# Altium schematic sheet MainBoard V03.SchDoc
size A3
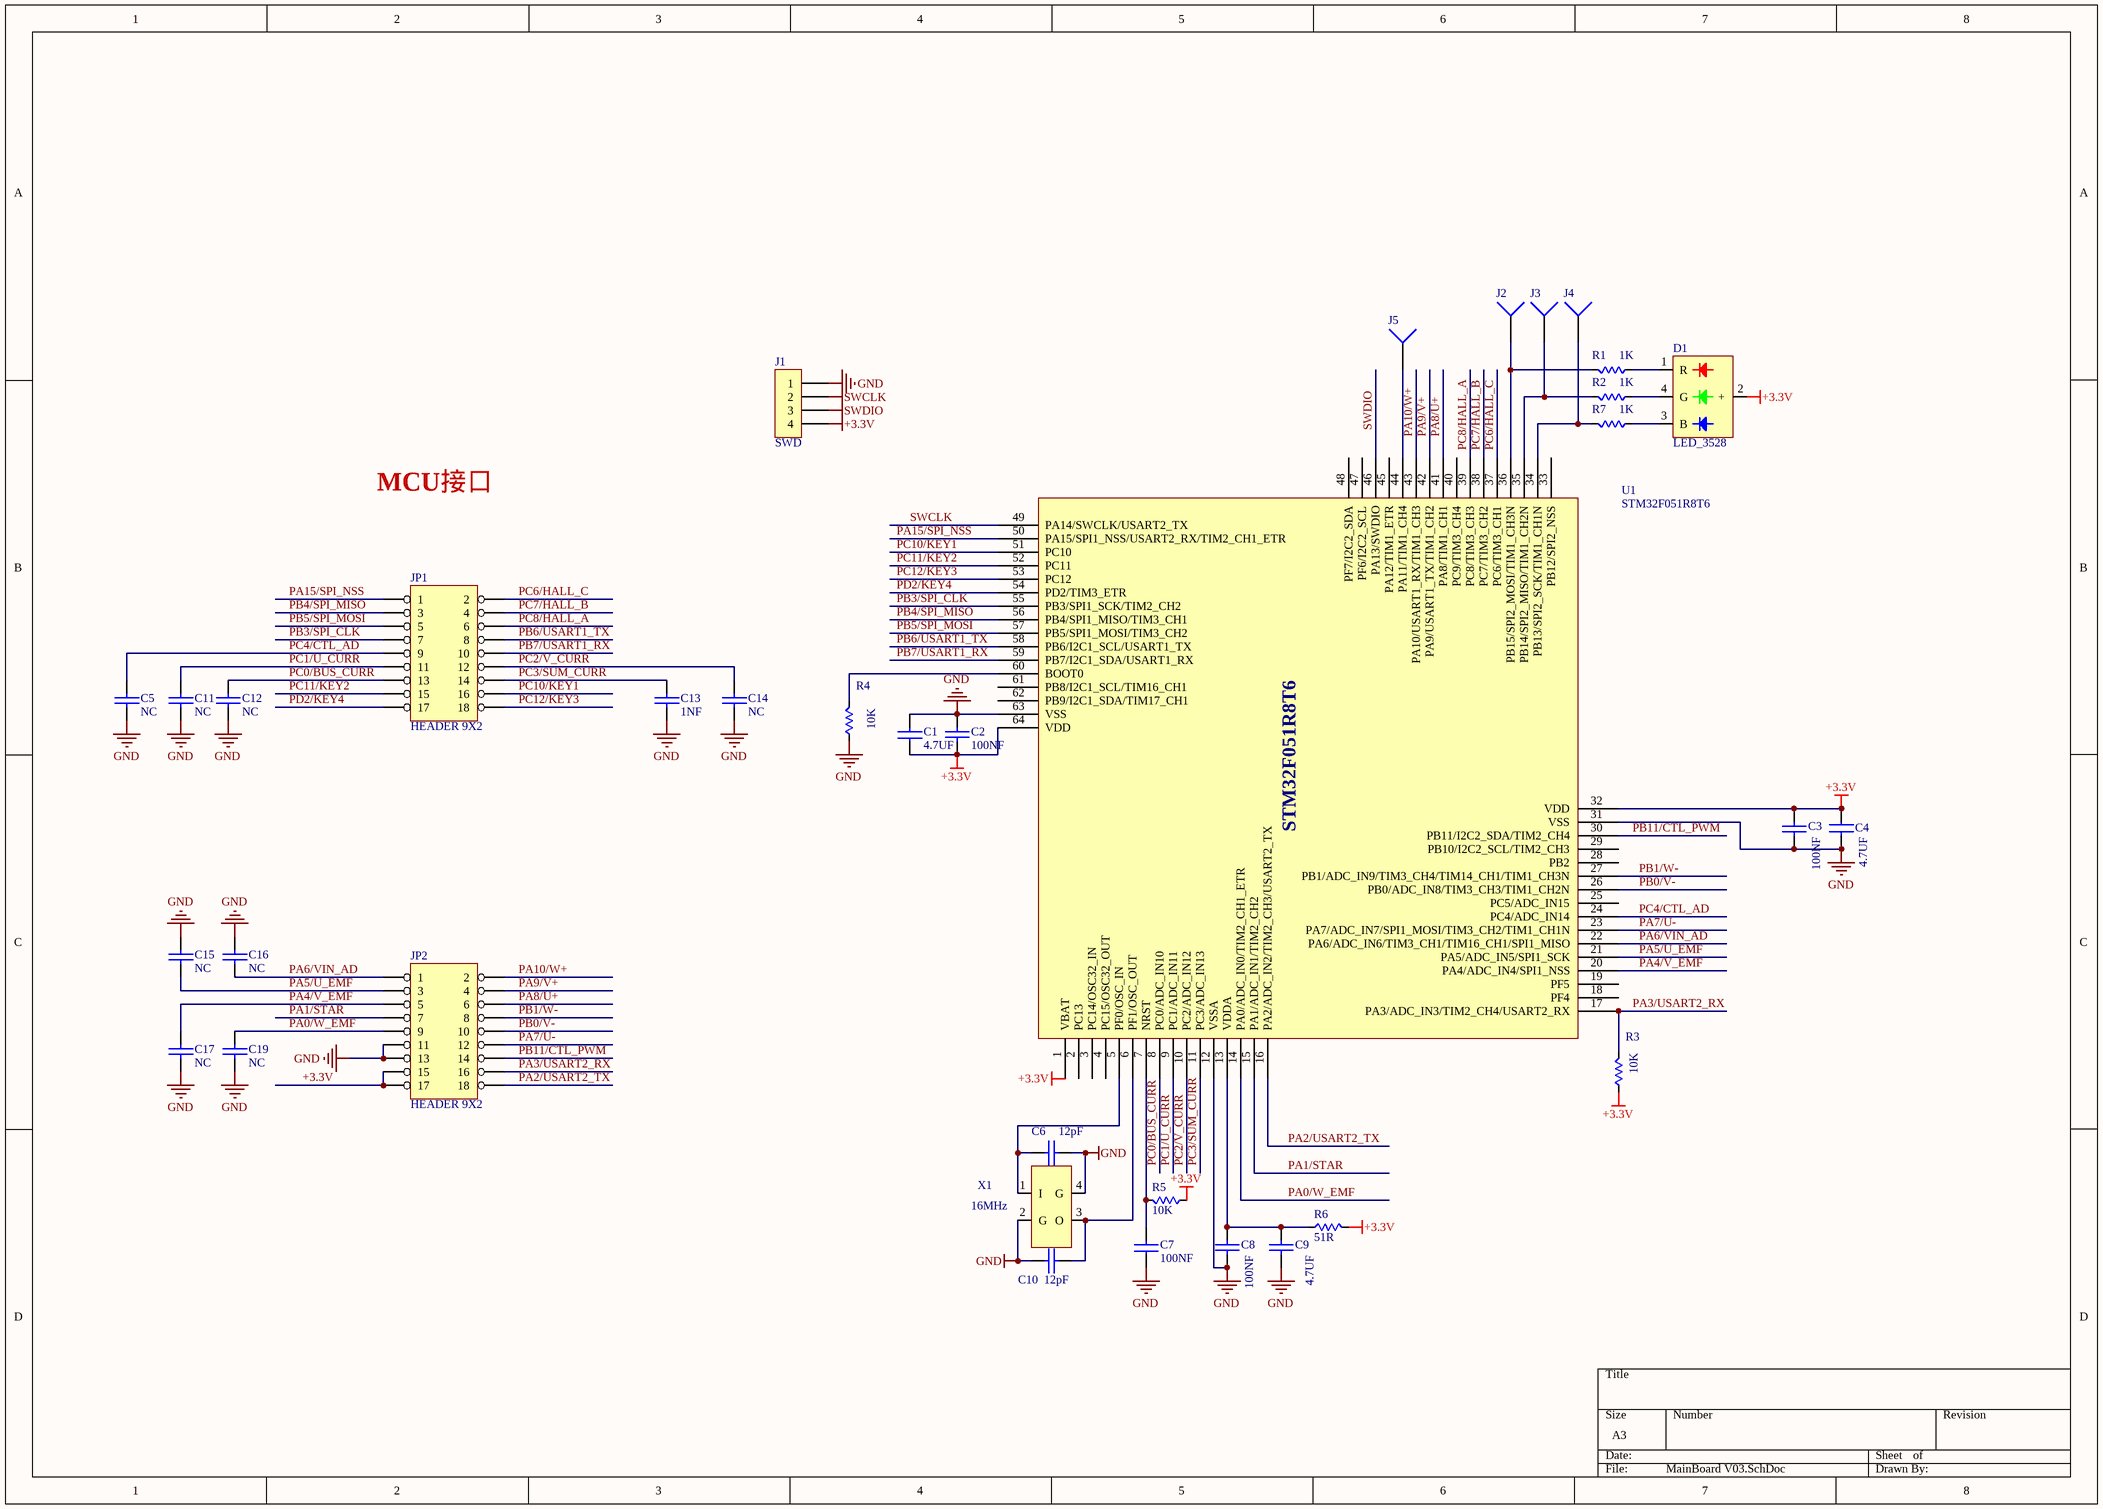
[diagram p0: MainBoard V03.SchDoc]

## Parts
C1  4.7UF  [0805C]
C2  100NF  [0603C]
C3  100NF  [0603C]
C4  4.7UF  [0805C]
C5  NC  [0603C]
C6  12pF  [0603C]
C7  100NF  [0603C]
C8  100NF  [0603C]
C9  4.7UF  [0805C]
C10  12pF  [0603C]
C11  NC  [0603C]
C12  NC  [0603C]
C13  1NF  [0603C]
C14  NC  [0603C]
C15  NC  [0603C]
C16  NC  [0603C]
C17  NC  [0603C]
C19  NC  [0603C]
D1  LED_3528  [LED3528]
J1  SWD  [SIP4]
J2  (no value)  [TPJ1.3A]
J3  (no value)  [TPJ1.3A]
J4  (no value)  [TPJ1.3A]
J5  (no value)  [PLUG]
JP1  HEADER 9X2  [SMT2.54-2X9-M-MIRROR]
JP2  HEADER 9X2  [SMT2.54-2X9-M-MIRROR]
R1  1K  [0603R]
R2  1K  [0603R]
R3  10K  [0603R]
R4  10K  [0603R]
R5  10K  [0603R]
R6  51R  [0603R]
R7  1K  [0603R]
U1  STM32F051R8T6  [LQFP-64]
X1  16MHz  [Y3225]

## Nets
+3.3V: C1.1 C2.1 C3.1 C4.1 D1.2(+) J1.4 JP2.15 JP2.17 R3.2 R5.2 R6.1 U1.1(VBAT) U1.32(VDD) U1.64(VDD)
GND: C1.2 C2.2 C3.2 C4.2 C5.2 C6.1 C7.1 C8.2 C9.2 C10.1 C11.2 C12.2 C13.2 C14.2 C15.2 C16.2 C17.2 C19.2 J1.1 JP2.11 JP2.13 R4.2 U1.12(VSSA) U1.31(VSS) U1.63(VSS) X1.2(G) X1.4(G)
SWCLK: J1.2 U1.49(PA14/SWCLK/USART2_TX)
SWDIO: J1.3 U1.46(PA13/SWDIO)
PA0/W_EMF: C19.1 JP2.9 U1.14(PA0/ADC_IN0/TIM2_CH1_ETR)
PA1/STAR: JP2.7 U1.15(PA1/ADC_IN1/TIM2_CH2)
PA2/USART2_TX: JP2.18 U1.16(PA2/ADC_IN2/TIM2_CH3/USART2_TX)
PA3/USART2_RX: JP2.16 R3.1 U1.17(PA3/ADC_IN3/TIM2_CH4/USART2_RX)
PA4/V_EMF: C17.1 JP2.5 U1.20(PA4/ADC_IN4/SPI1_NSS)
PA5/U_EMF: C15.1 JP2.3 U1.21(PA5/ADC_IN5/SPI1_SCK)
PA6/VIN_AD: C16.1 JP2.1 U1.22(PA6/ADC_IN6/TIM3_CH1/TIM16_CH1/SPI1_MISO)
PA7/U-: JP2.12 U1.23(PA7/ADC_IN7/SPI1_MOSI/TIM3_CH2/TIM1_CH1N)
PA8/U+: JP2.6 U1.41(PA8/TIM1_CH1)
PA9/V+: JP2.4 U1.42(PA9/USART1_TX/TIM1_CH2)
PA10/W+: JP2.2 U1.43(PA10/USART1_RX/TIM1_CH3)
PA15/SPI_NSS: JP1.1 U1.50(PA15/SPI1_NSS/USART2_RX/TIM2_CH1_ETR)
PB0/V-: JP2.10 U1.26(PB0/ADC_IN8/TIM3_CH3/TIM1_CH2N)
PB1/W-: JP2.8 U1.27(PB1/ADC_IN9/TIM3_CH4/TIM14_CH1/TIM1_CH3N)
PB3/SPI_CLK: JP1.7 U1.55(PB3/SPI1_SCK/TIM2_CH2)
PB4/SPI_MISO: JP1.3 U1.56(PB4/SPI1_MISO/TIM3_CH1)
PB5/SPI_MOSI: JP1.5 U1.57(PB5/SPI1_MOSI/TIM3_CH2)
PB6/USART1_TX: JP1.8 U1.58(PB6/I2C1_SCL/USART1_TX)
PB7/USART1_RX: JP1.10 U1.59(PB7/I2C1_SDA/USART1_RX)
PB11/CTL_PWM: JP2.14 U1.30(PB11/I2C2_SDA/TIM2_CH4)
PC0/BUS_CURR: C12.1 JP1.13 U1.8(PC0/ADC_IN10)
PC1/U_CURR: C11.1 JP1.11 U1.9(PC1/ADC_IN11)
PC2/V_CURR: C14.1 JP1.12 U1.10(PC2/ADC_IN12)
PC3/SUM_CURR: C13.1 JP1.14 U1.11(PC3/ADC_IN13)
PC4/CTL_AD: C5.1 JP1.9 U1.24(PC4/ADC_IN14)
PC6/HALL_C: JP1.2 U1.37(PC6/TIM3_CH1)
PC7/HALL_B: JP1.4 U1.38(PC7/TIM3_CH2)
PC8/HALL_A: JP1.6 U1.39(PC8/TIM3_CH3)
PC10/KEY1: JP1.16 U1.51(PC10)
PC11/KEY2: JP1.15 U1.52(PC11)
PC12/KEY3: JP1.18 U1.53(PC12)
PD2/KEY4: JP1.17 U1.54(PD2/TIM3_ETR)
NetC6_2: C6.2 U1.5(PF0/OSC_IN) X1.1(I)
NetC7_2: C7.2 R5.1 U1.7(NRST)
NetC8_1: C8.1 C9.1 R6.2 U1.13(VDDA)
NetC10_2: C10.2 U1.6(PF1/OSC_OUT) X1.3(O)
NetD1_1: D1.1(R) R1.1
NetD1_3: D1.3(B) R7.1
NetD1_4: D1.4(G) R2.1
NetJ2_1: J2.1 R1.2 U1.36(PB15/SPI2_MOSI/TIM1_CH3N)
NetJ3_1: J3.1 R2.2 U1.35(PB14/SPI2_MISO/TIM1_CH2N)
NetJ4_1: J4.1 R7.2 U1.34(PB13/SPI2_SCK/TIM1_CH1N)
NetJ5_1: J5.1 U1.44(PA11/TIM1_CH4)
NetR4_1: R4.1 U1.60(BOOT0)

Not connected (* = marked no-connect by the designer): U1 2(PC13) 3(PC14/OSC32_IN) 4(PC15/OSC32_OUT) 18(PF4) 19(PF5) 25(PC5/ADC_IN15) 28(PB2) 29(PB10/I2C2_SCL/TIM2_CH3) 33(PB12/SPI2_NSS) 40(PC9/TIM3_CH4) 45(PA12/TIM1_ETR) 47(PF6/I2C2_SCL) 48(PF7/I2C2_SDA) 61(PB8/I2C1_SCL/TIM16_CH1) 62(PB9/I2C1_SDA/TIM17_CH1)

## Notes on the sheet
- MCU接口

## Library data of the parts
C1 C4 = CAP NP: Text Field1: 20; Text Field2: 10
C2 C3 C5 C8 C9 C11-C17 C19 = CAP: Y02-02238
C6 C10 = CAP: Capacitor
C7 = CAP NP: Y02-02238; Text Field1: 20; Text Field2: 10
J1 = CON4: Connector
J2-J5 = Socket: Plug; LatestRevisionDate: 17-Jul-2002; LatestRevisionNote: Re-released for DXP Platform.; Publisher: Altium Limited
R1 R2 R7 = RES: Y02-00493
R3 = RES
R4-R6 = RES: Y02-01715
X1 = CON4A_1: Text Field1: 60; Text Field2: 30